# Altium schematic sheet POWER SECTION.SchDoc
size A4; Organization: Altium Limited; Address1: L3, 12a Rodborough Rd; Address2: Frenchs Forest; Address3: NSW; Address4: Australia 2086
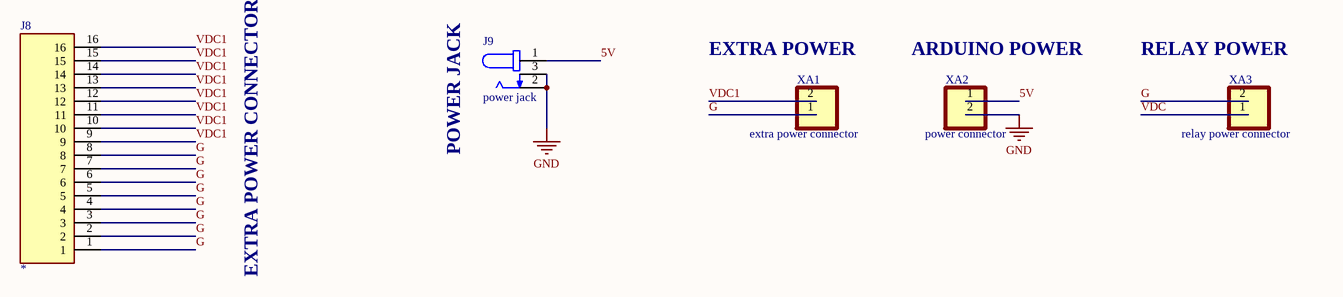
[diagram p0: POWER SECTION.SchDoc]

## Parts
J8  1-215297-6  [TE_1-215297-6]  (value not drawn)
J9  power jack  [CUI_PJ-202A]
XA1  extra power connector  [PHOENIX_MKDS1/2-3.81]
XA2  power connector  [PHOENIX_MKDS1/2-3.81]
XA3  relay power connector  [PHOENIX_MKDS1/2-3.81]

## Nets
GND: J9.2 J9.3 XA2.2
5V: J9.1 XA2.1
G: J8.1 J8.2 J8.3 J8.4 J8.5 J8.6 J8.7 J8.8 XA1.1 XA3.2
VDC: XA3.1
VDC1: J8.9 J8.10 J8.11 J8.12 J8.13 J8.14 J8.15 J8.16 XA1.2

## Notes on the sheet
- (near XA1) EXTRA POWER
- (near XA2) ARDUINO POWER
- (near XA3) RELAY POWER
- POWER JACK
- EXTRA POWER CONNECTOR
- Title
- Size:
- Date:
- A4
- Number:
- Time:
- Revision:
- Sheet
- of
- File:

## Library data of the parts
J8 = 1-215297-6: Ú©Ø§Ø±ØªÙ† Ø§ØªØµØ§Ù„ Ø³ÙˆÚ©Øª Ù†ÙˆØ§Ø± SKT 16 POS 2.54 Ù…ÛŒÙ„ÛŒ Ù…ØªØ± Ù„Ø­ÛŒÙ… Ú©Ø§Ø±ÛŒ ST Thru-Hole; Number_of_Positions: 16; Centerline_Pitch: 2.54 mm[.1 in]; Product_Type: Connector; MF: TE Connectivity; Purchase-URL: https://pricing.snapeda.com/search/part/1-215297-6/?ref=eda; Package: None; MP: 1-215297-6; Value: *; Price: None; Availability: Good; SnapEDA_Link: https://www.snapeda.com/parts/1-215297-6/TE%20Connectivity%20AMP%20Connectors/view-part/449123/?ref=snap; EU_RoHS_Compliance: Compliant; Check_prices: https://www.snapeda.com/parts/1-215297-6/TE%20Connectivity%20AMP%20Connectors/view-part/449123/?ref=eda; Comment_1: *
J9 = PJ-202A: 2.0 x 6.5 mm, 2.5 A, Horizontal, Through Hole, Kinked Pins, Dc Power Jack Connector; MF: CUI Devices; Availability: Unavailable; Package: None; SnapEDA_Link: https://www.snapeda.com/parts/PJ-202A/CUI%20Devices/view-part/153805/?ref=snap; MP: PJ-202A; Price: None; CUI_purchase_URL: https://www.cuidevices.com/product/interconnect/connectors/dc-power-connectors/jacks/pj-202a?utm_source=snapeda.com&utm_medium=referral&utm_campaign=snapedaBOM; Value: *
XA1-XA3 = MKDS1/2-3.81: 2 Position Wire to Board Terminal Block Horizontal with Board 0.150 _3.81mm_ Through Hole; MF: Phoenix Contact; Package: None; Price: None; SnapEDA_Link: https://www.snapeda.com/parts/MKDS%201/%202-3.81/Phoenix%20Contact/view-part/114562/?ref=snap; Availability: Unavailable; Value: *; MP: MKDS 1/ 2-3.81